# Altium schematic sheet Power_supply.SchDoc
size A4
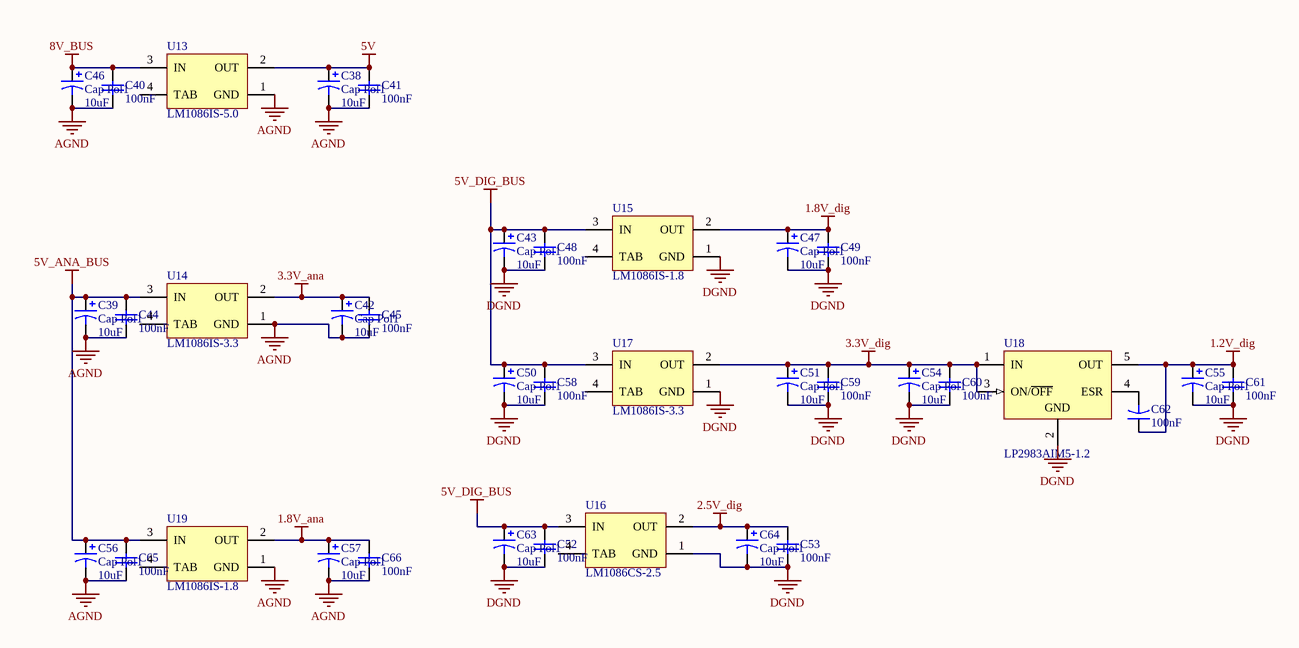
[diagram p0: Power_supply.SchDoc]

## Parts
C38  Cap Pol1  value 10uF  [B]
C39  Cap Pol1  value 10uF  [B]
C40  value 100nF  [CAPC2012L]  (hidden comment: Cap Semi)
C41  value 100nF  [CAPC2012L]  (hidden comment: Cap Semi)
C42  Cap Pol1  value 10uF  [B]
C43  Cap Pol1  value 10uF  [B]
C44  value 100nF  [CAPC2012L]  (hidden comment: Cap Semi)
C45  value 100nF  [CAPC2012L]  (hidden comment: Cap Semi)
C46  Cap Pol1  value 10uF  [B]
C47  Cap Pol1  value 10uF  [B]
C48  value 100nF  [CAPC2012L]  (hidden comment: Cap Semi)
C49  value 100nF  [CAPC2012L]  (hidden comment: Cap Semi)
C50  Cap Pol1  value 10uF  [B]
C51  Cap Pol1  value 10uF  [B]
C52  value 100nF  [CAPC2012L]  (hidden comment: Cap Semi)
C53  value 100nF  [CAPC2012L]  (hidden comment: Cap Semi)
C54  Cap Pol1  value 10uF  [B]
C55  Cap Pol1  value 10uF  [B]
C56  Cap Pol1  value 10uF  [B]
C57  Cap Pol1  value 10uF  [B]
C58  value 100nF  [CAPC2012L]  (hidden comment: Cap Semi)
C59  value 100nF  [CAPC2012L]  (hidden comment: Cap Semi)
C60  value 100nF  [CAPC2012L]  (hidden comment: Cap Semi)
C61  value 100nF  [CAPC2012L]  (hidden comment: Cap Semi)
C62  value 100nF  [CAPC2012L]  (hidden comment: Cap)
C63  Cap Pol1  value 10uF  [B]
C64  Cap Pol1  value 10uF  [B]
C65  value 100nF  [CAPC2012L]  (hidden comment: Cap Semi)
C66  value 100nF  [CAPC2012L]  (hidden comment: Cap Semi)
U13  LM1086IS-5.0  [TS3B_N]
U14  LM1086IS-3.3  [TS3B_N]
U15  LM1086IS-1.8  [TS3B_N]
U16  LM1086CS-2.5  [TS3B_N]
U17  LM1086IS-3.3  [TS3B_N]
U18  LP2983AIM5-1.2  [MF05A_N]
U19  LM1086IS-1.8  [TS3B_N]

## Nets
1.2V_dig: C55.1 C61.2 C62.1 U18.5(OUT)
1.8V_ana: C57.1 C66.2 U19.2(OUT)
1.8V_dig: C47.1 C49.2 U15.2(OUT)
2.5V_dig: C53.2 C64.1 U16.2(OUT)
3.3V_ana: C42.1 C45.2 U14.2(OUT)
3.3V_dig: C51.1 C54.1 C59.2 C60.2 U17.2(OUT) U18.1(IN) U18.3(ON/~{OFF})
5V: C38.1 C41.2 U13.2(OUT)
5V_ANA_BUS: C39.1 C44.2 C56.1 C65.2 U14.3(IN) U19.3(IN)
5V_DIG_BUS: C43.1 C48.2 C50.1 C52.2 C58.2 C63.1 U15.3(IN) U16.3(IN) U17.3(IN)
8V_BUS: C40.2 C46.1 U13.3(IN)
AGND: C38.2 C39.2 C40.1 C41.1 C42.2 C44.1 C45.1 C46.2 C56.2 C57.2 C65.1 C66.1 U13.1(GND) U14.1(GND) U19.1(GND)
DGND: C43.2 C47.2 C48.1 C49.1 C50.2 C51.2 C52.1 C53.1 C54.2 C55.2 C58.1 C59.1 C60.1 C61.1 C63.2 C64.2 U15.1(GND) U16.1(GND) U17.1(GND) U18.2(GND)
NetC62_2: C62.2 U18.4(ESR)

Not connected (* = marked no-connect by the designer): U13 4(TAB); U14 4(TAB); U15 4(TAB); U16 4(TAB); U17 4(TAB); U19 4(TAB)

## Library data of the parts
C38 C39 C42 C43 C46 C47 C50 C51 C54-C57 C63 C64 = Cap Pol1: Polarized Capacitor (Radial); Voltage: 16V; Published: 8-Jun-2000; LatestRevisionDate: 17-Jul-2002; LatestRevisionNote: Re-released for DXP Platform.; PackageReference: RB7.6-15; Publisher: Altium Limited
C40 C41 C44 C45 C48 C49 C52 C53 C58-C61 C65 C66 = Cap Semi: Capacitor (Semiconductor SIM Model); Published: 8-Jun-2000; LatestRevisionDate: 29-May-2009; LatestRevisionNote: IPC-7351 Footprint Added.; PackageReference: C1206; Publisher: Altium Limited; PackageDescription: Chip Capacitor
C62 = Cap2: Capacitor; Published: 23-Sep-2002; PackageReference: CAPR5-4X5; Publisher: Altium Limited
U13 = LM1086IS-5.0: 1.5A Low Dropout Positive Regulators; Manufacturer: National Semiconductor; CompType: LDO IC; PackageTopMarking: NSUZXYTTE#*LM1086*IS-5.0; PowerWise: N; Published: 4-Dec-2008; DatasheetVersion: Jun-2005; PackageVersion: revF, Apr-2005; PackageReference: TS3B; Publisher: Altium Limited; PackageDescription: TO-263, Molded, .400 x .390 x .180in, 3 Lead, .1in Pitch, Surface Mount; PartNumber: LM1086IS-5.0; RoHS: O; PinCount: 3; DigiKeyPartNumber: LM1086IS-5.0-ND; Code_JEDEC: MO-169-AA; ComponentLink1Description: LM1086 Datasheet; ComponentLink1URL: http://www.national.com/ds/LM/LM1086.pdf; ComponentLink2Description: LM1086 Web Page; ComponentLink2URL: http://www.national.com/pf/LM/LM1086.html; ComponentLink3Description: TS3B Package Page; ComponentLink3URL: http://www.national.com/packaging/folders/ts3b.html
U14 U16 U17 = LM1086IS-3.3: 1.5A Low Dropout Positive Regulators; Manufacturer: National Semiconductor; CompType: LDO IC; PackageTopMarking: NSUZXYTTE#*LM1086*IS-3.3; PowerWise: N; Published: 4-Dec-2008; DatasheetVersion: Jun-2005; PackageVersion: revF, Apr-2005; PackageReference: TS3B; Publisher: Altium Limited; PackageDescription: TO-263, Molded, .400 x .390 x .180in, 3 Lead, .1in Pitch, Surface Mount; PartNumber: LM1086IS-3.3; RoHS: O; PinCount: 3; DigiKeyPartNumber: LM1086IS-3.3-ND; Code_JEDEC: MO-169-AA; ComponentLink1Description: LM1086 Datasheet; ComponentLink1URL: http://www.national.com/ds/LM/LM1086.pdf; ComponentLink2Description: LM1086 Web Page; ComponentLink2URL: http://www.national.com/pf/LM/LM1086.html; ComponentLink3Description: TS3B Package Page; ComponentLink3URL: http://www.national.com/packaging/folders/ts3b.html
U15 U19 = LM1086IS-1.8: 1.5A Low Dropout Positive Regulators; Manufacturer: National Semiconductor; CompType: LDO IC; PackageTopMarking: NSUZXYTTE#*LM1086*IS-1.8; PowerWise: N; Published: 4-Dec-2008; DatasheetVersion: Jun-2005; PackageVersion: revF, Apr-2005; PackageReference: TS3B; Publisher: Altium Limited; PackageDescription: TO-263, Molded, .400 x .390 x .180in, 3 Lead, .1in Pitch, Surface Mount; PartNumber: LM1086IS-1.8; RoHS: O; PinCount: 3; DigiKeyPartNumber: LM1086IS-1.8-ND; Code_JEDEC: MO-169-AA; ComponentLink1Description: LM1086 Datasheet; ComponentLink1URL: http://www.national.com/ds/LM/LM1086.pdf; ComponentLink2Description: LM1086 Web Page; ComponentLink2URL: http://www.national.com/pf/LM/LM1086.html; ComponentLink3Description: TS3B Package Page; ComponentLink3URL: http://www.national.com/packaging/folders/ts3b.html
U18 = LP2983AIM5-1.2: Micropower 150 mA Voltage Regulator in SOT-23 Package For Output Voltages [Less_Than_Or_Equal] 1.2V; Manufacturer: National Semiconductor; CompType: LDO IC; PackageTopMarking: LELA*XTT; PowerWise: N; Published: 4-Dec-2008; DatasheetVersion: Apr-2005; PackageVersion: revD, Aug-2008; PackageReference: MF05A; Publisher: Altium Limited; PackageDescription: Molded SOT-23, .115 x .063 x .040 in Body, 5 Lead, .0375 in Pitch; PartNumber: LP2983AIM5-1.2; RoHS: O; PinCount: 5; DigiKeyPartNumber: LP2983AIM5-1.2CT-ND; ComponentLink1Description: LP2983 Datasheet; ComponentLink1URL: http://www.national.com/ds/LP/LP2983.pdf; ComponentLink2Description: LP2983 Web Page; ComponentLink2URL: http://www.national.com/pf/LP/LP2983.html; ComponentLink3Description: MF05A Package Page; ComponentLink3URL: http://www.national.com/packaging/folders/mf05a.html